# EAGLE schematic ThoraxSensor3.0.6_2024_VCNT2020 (EAGLE 9.6.2)
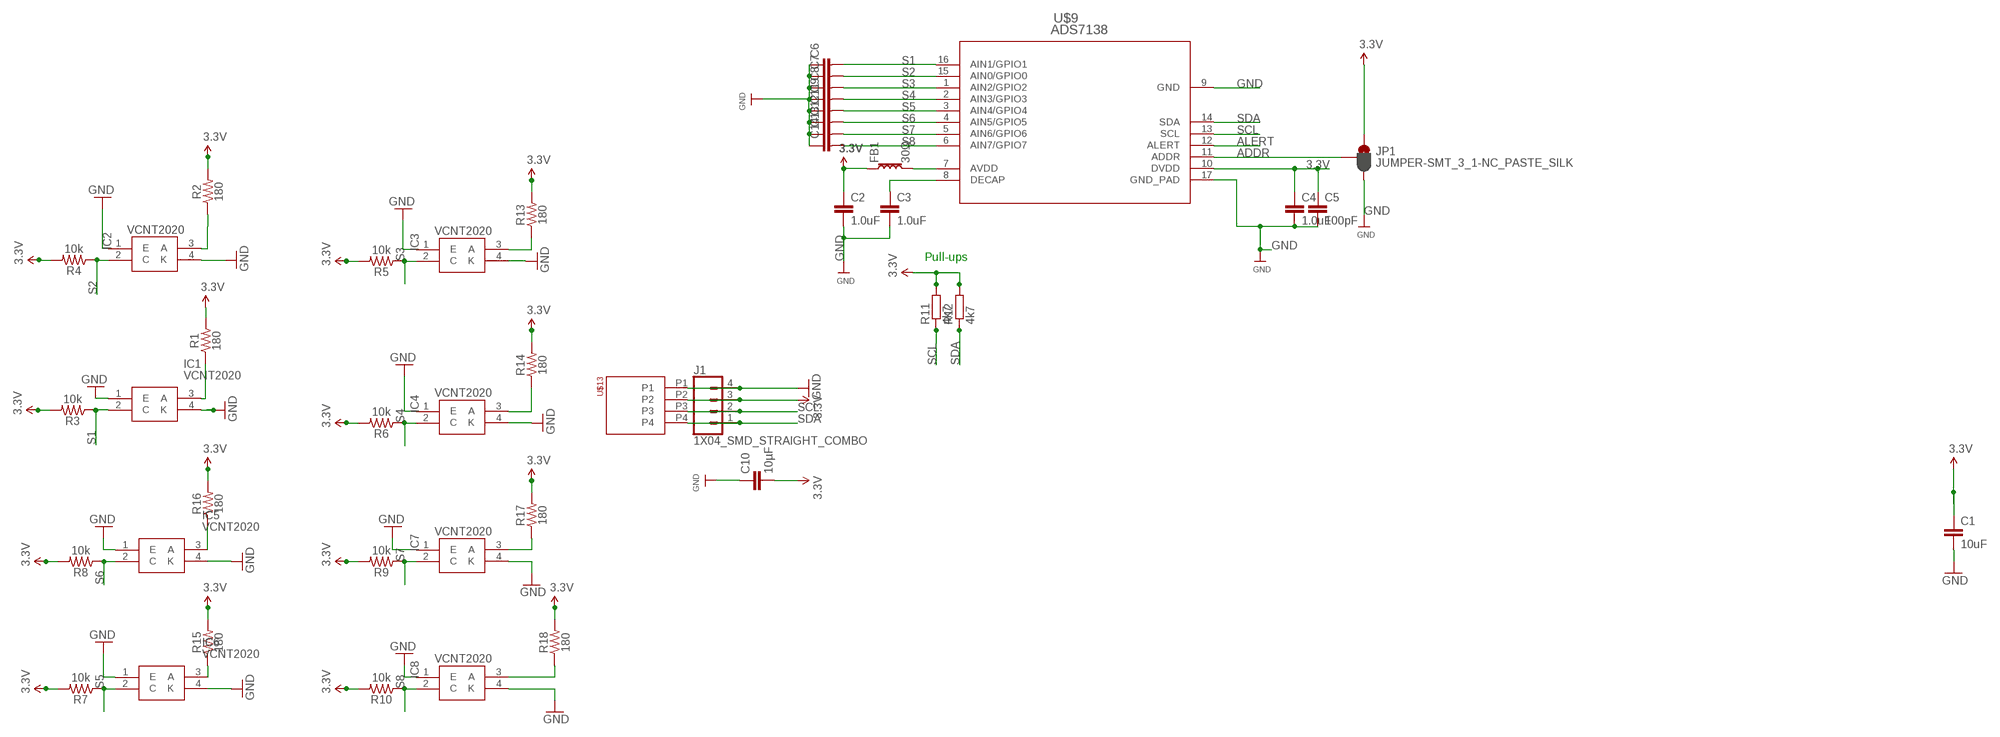
[diagram p0: schematic, sheet 1]

## Parts
C1  10uF  10UF-0805-10V-10%  [0805]
C2  1.0uF  1.0UF-0603-16V-10%  [0603]
C3  1.0uF  1.0UF-0603-16V-10%  [0603]
C4  1.0uF  1.0UF-0603-16V-10%  [0603]
C5  100pF  100PF-0603-50V-5%  [0603]
C6  0.1uF  CAP_CERAMIC0603  [0603]
C7  0.1uF  CAP_CERAMIC0603  [0603]
C8  0.1uF  CAP_CERAMIC0603  [0603]
C9  0.1uF  CAP_CERAMIC0603  [0603]
C10  10µF  C-EUC0805  [C0805]
C11  0.1uF  CAP_CERAMIC0603  [0603]
C12  0.1uF  CAP_CERAMIC0603  [0603]
C13  0.1uF  CAP_CERAMIC0603  [0603]
C14  0.1uF  CAP_CERAMIC0603  [0603]
FB1  30Ω  FERRITE_BEAD-0603-30Ω-100MHZ  [0603]
IC1  VCNT2020  [VCNT2020]
IC2  VCNT2020  [VCNT2020]
IC3  VCNT2020  [VCNT2020]
IC4  VCNT2020  [VCNT2020]
IC5  VCNT2020  [VCNT2020]
IC6  VCNT2020  [VCNT2020]
IC7  VCNT2020  [VCNT2020]
IC8  VCNT2020  [VCNT2020]
J1  1X04_SMD_STRAIGHT_COMBO  CONN_04SMD_STRAIGHT_COMBO  [1X04_SMD_VERTICAL_COMBO]
JP1  JUMPER-SMT_3_1-NC_PASTE_SILK  [SMT-JUMPER_3_1-NC_PASTE_SILK]
R1  180  180OHM-0603-1/10W-1%  [0603]
R2  180  180OHM-0603-1/10W-1%  [0603]
R3  10k  10KOHM-0603-1/10W-1%  [0603]
R4  10k  10KOHM-0603-1/10W-1%  [0603]
R5  10k  10KOHM-0603-1/10W-1%  [0603]
R6  10k  10KOHM-0603-1/10W-1%  [0603]
R7  10k  10KOHM-0603-1/10W-1%  [0603]
R8  10k  10KOHM-0603-1/10W-1%  [0603]
R9  10k  10KOHM-0603-1/10W-1%  [0603]
R10  10k  10KOHM-0603-1/10W-1%  [0603]
R11  4k7  R-EU_R0603  [R0603]
R12  4k7  R-EU_R0603  [R0603]
R13  180  180OHM-0603-1/10W-1%  [0603]
R14  180  180OHM-0603-1/10W-1%  [0603]
R15  180  180OHM-0603-1/10W-1%  [0603]
R16  180  180OHM-0603-1/10W-1%  [0603]
R17  180  180OHM-0603-1/10W-1%  [0603]
R18  180  180OHM-0603-1/10W-1%  [0603]
U$9  ADS7138  [QFN_8IRTER_TEX]
U$13  PHOENIX_PTSM_M4_TH_ANGLEMIRRORED_SILK_I2C  [PTSM_M4_TH_ANGLE_NEUTRAL_MIRRORED]

## Nets
3.3V [pwr]: C1.1 C2.1 C4.1 C5.1 C10.2 FB1.1 J1.3 JP1.1 R1.2 R2.2 R3.2 R4.2 R5.2 R6.2 R7.2 R8.2 R9.2 R10.2 R11.2 R12.2 R13.2 R14.2 R15.2 R16.2 R17.2 R18.2 U$9.10(DVDD) U$13.P2
ADDR: JP1.2 U$9.11(ADDR)
ALERT: U$9.12(ALERT)
DECAP: C3.1 U$9.8(DECAP)
GND [pwr]: C1.2 C2.2 C3.2 C4.2 C5.2 C6.1 C7.1 C8.1 C9.1 C10.1 C11.1 C12.1 C13.1 C14.1 IC1.1(E) IC1.4(K) IC2.1(E) IC2.4(K) IC3.1(E) IC3.4(K) IC4.1(E) IC4.4(K) IC5.1(E) IC5.4(K) IC6.1(E) IC6.4(K) IC7.1(E) IC7.4(K) IC8.1(E) IC8.4(K) J1.4 JP1.3 U$9.9(GND) U$9.17(GND_PAD) U$13.P1
N$1: IC1.3(A) R1.1
N$2: IC2.3(A) R2.1
N$3: IC3.3(A) R13.1
N$4: IC4.3(A) R14.1
N$5: IC6.3(A) R15.1
N$6: IC5.3(A) R16.1
N$7: IC7.3(A) R17.1
N$8: IC8.3(A) R18.1
N$10: FB1.2 U$9.7(AVDD)
S1: C6.2 IC1.2(C) R3.1 U$9.16(AIN1/GPIO1)
S2: C7.2 IC2.2(C) R4.1 U$9.15(AIN0/GPIO0)
S3: C8.2 IC3.2(C) R5.1 U$9.1(AIN2/GPIO2)
S4: C9.2 IC4.2(C) R6.1 U$9.2(AIN3/GPIO3)
S5: C11.2 IC6.2(C) R7.1 U$9.3(AIN4/GPIO4)
S6: C12.2 IC5.2(C) R8.1 U$9.4(AIN5/GPIO5)
S7: C13.2 IC7.2(C) R9.1 U$9.5(AIN6/GPIO6)
S8: C14.2 IC8.2(C) R10.1 U$9.6(AIN7/GPIO7)
SCL: J1.2 R11.1 U$9.13(SCL) U$13.P3
SDA: J1.1 R12.1 U$9.14(SDA) U$13.P4

## Notes on the sheet
- Pull-ups

## Library data of the parts
C1 = SparkFun-Capacitors:10UF: 10.0µF ceramic capacitors A capacitor is a passive two-terminal electrical component used to store electrical energy temporarily in an electric field.; PROD_ID: CAP-11330
C2-C4 = SparkFun-Capacitors:1.0UF: 1µF ceramic capacitors A capacitor is a passive two-terminal electrical component used to store electrical energy temporarily in an electric field.; PROD_ID: CAP-00868
C5 = SparkFun-Capacitors:100PF: 100pF/0.1nF ceramic capacitors A capacitor is a passive two-terminal electrical component used to store electrical energy temporarily in an electric field.; PROD_ID: CAP-07883
C6-C9 C11-C14 = microbuilder:CAP_CERAMIC: Ceramic Capacitors 0402 - 0402 Surface Mount Capacitors 16pF 50V 5% [Digikey: 445-4899-2-ND] 18pF 50V 5% [Digikey: 490-1281-2-ND] 22pF 50V 5% [Digikey: 490-1283-2-ND] 68pF 50V 5% [Digikey: 490-1289-2-ND] 0.1uF 10V 10% [Digikey: 490-1318-2-ND] 1.0uF 6.3V 10% [Digikey: 490-1320-2-ND] 0603 - 0603 Surface Mount Capacitors 16 pF 50V 5% [Digikey: 445-5051-2-ND] 22 pF 50V [Digikey: PCC220ACVTR-ND] 33 pF 50V 5% [Digikey: 490-1415-1-ND] 56pF 50V 5% [Digikey: 490-1421-1-ND] 220pF 50V 5% [Digikey: 445-1285-1-ND] 680 pF 50V 2200 pF 50V 5% C0G [Digikey: 445-1297-1-ND] 5600 pF 100V 5% X7R [Digikey: 478-3711-1-ND] 0.1 µF 25V 10% [Digikey: PCC2277TR-ND] 0.22 µF 16V 10% X7R [Digikey: 445-1318-1-ND] 1.0 µF 25V 10% [Digikey: 445-5146-2-ND] 0603 - RF Specific 3pF 250V +/-0.1pF RF [Digikey: 712-1347-1-ND] 18 pF 250V 5% [Digikey: 478-3505-1-ND or 712-1322-1-ND] 56 pF 250V 5% C0G RF [Digikey: 490-4867-1-ND] 68 pF 250V RF [Digikey: 490-4868-1-ND] 0805 - 0805 Surface Mount Capacitors 220 pF 250V 2% RF Ceramic Capacitor [Digikey: 712-1398-1-ND] 1000 pF 50V 2% NP0 Ceramic Capacitor [Digikey: 478-3760-1-ND] 0.1 µF 25V 10% Ceramic Capacitor [Digikey: PCC1828TR-ND] 1.0 µF 16V 10% Ceramic Capacitor[Digikey: 490-1691-2-ND] 10.0 µF 10V 10% Ceramic Capacitor[Digikey: 709-1228-1-ND] 10.0 uF 16V 10% Ceramic Capacitor [Digikey: 478-5165-2-ND] 47 uF 6.3V 20% Ceramic Capacitor [Digikey: 587-1779-1-ND or 399-5506-1-ND] 1206 - 1206 Surface Mount Capacitors 47uF 10V 20% Ceramic Capacitor [Digikey: 490-5528-1-ND or 399-5508-1-ND or 445-6010-1-ND] 100uF 6.3V -20%, +80% Y5V Ceramic Capacitor (Digikey: 490-4512-1-ND, Mouser: 81-GRM31CF50J107ZE1L)
C10 = rcl:C-EU: CAPACITOR, European symbol; SPICEPREFIX: C
FB1 = SparkFun-Coils:FERRITE_BEAD: Ferrite Bead (blocks, cores, rings, chokes, etc.) Inductor with layers of ferrite used to suppress high frequencies. Often used to isolate high frequency noise. SparkFun Products: IOIO-OTG - V2.2 <https://www.sparkfun.com/products/13613> SparkFun SAMD21 Mini Breakout <https://www.sparkfun.com/products/13664> SparkFun 6 Degrees of Freedom Breakout - LSM6DS3 <https://www.sparkfun.com/products/13339> SparkFun SAMD21 Dev Breakout <https://www.sparkfun.com/products/13672> Lilypad MP3 <https://www.sparkfun.com/products/11013>; PROD_ID: NDUC-07859
IC1-IC8 = VCNT2020:VCNT2020: Optical Switches, Reflective, Phototransistor Output Ref Optical Sensor Transtr Output 940nm Source: Datasheet <https://www.vishay.com/docs/84285/vcnt2020.pdf>; DESCRIPTION: Optical Switches, Reflective, Phototransistor Output Ref Optical Sensor Transtr Output 940nm; HEIGHT: 0mm; MANUFACTURER_NAME: Vishay; MANUFACTURER_PART_NUMBER: VCNT2020; MOUSER_PART_NUMBER: 78-VCNT2020; MOUSER_PRICE-STOCK: https://www.mouser.co.uk/ProductDetail/Vishay-Semiconductors/VCNT2020?qs=A6JNR%252BY%2FHHeERL3sVKpQTg%3D%3D
J1 = SparkFun-Connectors:CONN_04: Multi connection point. Often used as Generic Header-pin footprint for 0.1 inch spaced/style header connections On any of the 0.1 inch spaced packages, you can populate with these: Break Away Headers - Straight <https://www.sparkfun.com/products/116> (PRT-00116) Break Away Male Headers - Right Angle <https://www.sparkfun.com/products/553> (PRT-00553) Female Headers <https://www.sparkfun.com/products/115> (PRT-00115) Break Away Headers - Machine Pin <https://www.sparkfun.com/products/117> (PRT-00117) Break Away Female Headers - Swiss Machine Pin <https://www.sparkfun.com/products/743> (PRT-00743) For SCREWTERMINALS and SPRING TERMINALS visit here: Screw Terimnals on SparkFun.com <https://www.sparkfun.com/search/results?term=Screw+Terminals> (5mm/3.5mm/2.54mm spacing) This device is also useful as a general connection point to wire up your design to another part of your project. Our various solder wires solder well into these plated through hole pads. Hook-Up Wire - Assortment (Stranded, 22 AWG) <https://www.sparkfun.com/products/11375> (PRT-11375) Hook-Up Wire - Assortment (Solid Core, 22 AWG) <https://www.sparkfun.com/products/11367> (PRT-11367) View the entire wire category on our website here <https://www.sparkfun.com/categories/141> Special notes: Molex polarized connector foot print use with SKU : PRT-08231 with associated crimp pins and housings. 1MM SMD Version SKU: PRT-10208; PROD_ID: CONN-08511
JP1 = SparkFun-Jumpers:JUMPER-SMT_3_1-NC_PASTE: Normally closed solder jumper (1 of 2 connections) This jumper has an aperture in the stencil to allow solder paste to bridge one of the two connections. One connection is normally closed (NC), while the other is normally open (NO). Wick off the solder to open the connection. Reapply solder to reclose the connection. Apply solder to the other side instead to change the current path.
R1 R2 R13-R18 = SparkFun-Resistors:180OHM: 180Ω resistor A resistor is a passive two-terminal electrical component that implements electrical resistance as a circuit element. Resistors act to reduce current flow, and, at the same time, act to lower voltage levels within circuits. - Wikipedia; PROD_ID: RES-08788
R3-R10 = SparkFun-Resistors:10KOHM: 10kΩ resistor A resistor is a passive two-terminal electrical component that implements electrical resistance as a circuit element. Resistors act to reduce current flow, and, at the same time, act to lower voltage levels within circuits. - Wikipedia; PROD_ID: RES-00824
R11 R12 = rcl:R-EU_: RESISTOR, European symbol; SPICEPREFIX: R
U$9 = ADS7138:ADS7138
U$13 = jk_customs:PHOENIX_PTSM_M4_TH_ANGLE

## Net classes
1 pwr: width 0.254 mm